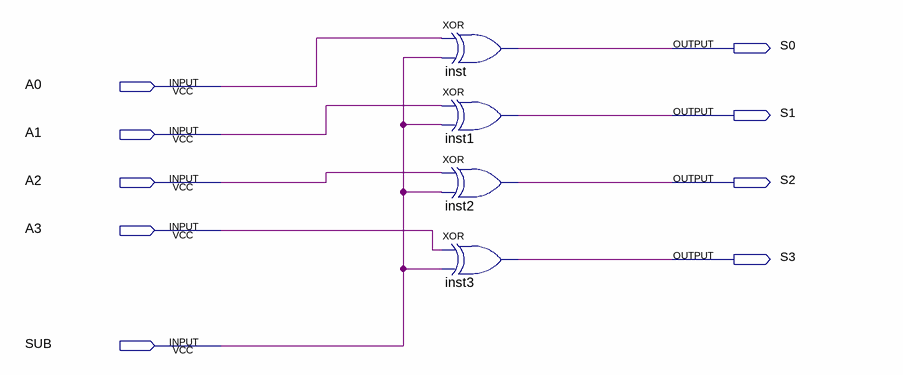
[diagram p0: schematic sheet]
// Quartus schematic INVERSOR.bdf as structural Verilog: 4 symbols, 9 pins
module INVERSOR (
  input  A0,
  input  A1,
  input  A2,
  input  A3,
  input  SUB,
  output S0,
  output S1,
  output S2,
  output S3
);

  xor inst (S0, A0, SUB);
  xor inst1 (S1, A1, SUB);
  xor inst2 (S2, A2, SUB);
  xor inst3 (S3, A3, SUB);
endmodule
